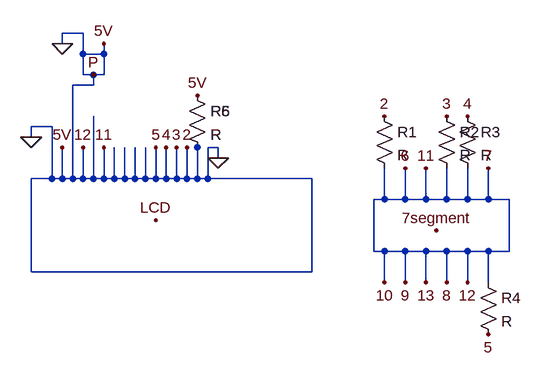
[diagram p0: schematic Polihack_circuit_arduino_pins.asc]
Polihack_circuit_arduino_pins.asc, the LTspice schematic file:
Version 4.1
SHEET 1 880 680
WIRE -496 -160 -528 -160
WIRE -528 -144 -528 -160
WIRE -496 -128 -496 -160
WIRE -464 -128 -464 -144
WIRE -464 -128 -496 -128
WIRE -496 -96 -496 -128
WIRE -480 -96 -496 -96
WIRE -464 -96 -464 -128
WIRE -464 -96 -480 -96
WIRE -480 -80 -480 -96
WIRE -480 -80 -512 -80
WIRE -544 -16 -576 -16
WIRE -576 0 -576 -16
WIRE -288 16 -304 16
WIRE -288 32 -288 16
WIRE -544 64 -544 -16
WIRE -544 64 -576 64
WIRE -528 64 -528 16
WIRE -528 64 -544 64
WIRE -512 64 -512 -80
WIRE -512 64 -528 64
WIRE -496 64 -496 16
WIRE -496 64 -512 64
WIRE -480 64 -480 -32
WIRE -480 64 -496 64
WIRE -464 64 -464 16
WIRE -464 64 -480 64
WIRE -448 64 -448 16
WIRE -448 64 -464 64
WIRE -432 64 -432 16
WIRE -432 64 -448 64
WIRE -416 64 -416 16
WIRE -416 64 -432 64
WIRE -400 64 -400 16
WIRE -400 64 -416 64
WIRE -384 64 -384 16
WIRE -384 64 -400 64
WIRE -368 64 -368 16
WIRE -368 64 -384 64
WIRE -352 64 -352 16
WIRE -352 64 -368 64
WIRE -336 64 -336 16
WIRE -336 64 -352 64
WIRE -320 64 -320 16
WIRE -320 64 -336 64
WIRE -304 64 -304 16
WIRE -304 64 -320 64
WIRE -144 64 -304 64
WIRE -32 96 -32 48
WIRE -32 96 -48 96
WIRE 0 96 0 48
WIRE 0 96 -32 96
WIRE 32 96 32 48
WIRE 32 96 0 96
WIRE 64 96 64 48
WIRE 64 96 32 96
WIRE 96 96 96 48
WIRE 96 96 64 96
WIRE 128 96 128 48
WIRE 128 96 96 96
WIRE 160 96 128 96
WIRE -48 176 -48 96
WIRE -32 176 -48 176
WIRE 0 176 -32 176
WIRE 32 176 0 176
WIRE 64 176 32 176
WIRE 96 176 64 176
WIRE 128 176 96 176
WIRE 160 176 160 96
WIRE 160 176 128 176
WIRE -576 208 -576 64
WIRE -144 208 -144 64
WIRE -144 208 -576 208
WIRE -32 224 -32 176
WIRE 0 224 0 176
WIRE 32 224 32 176
WIRE 64 224 64 176
WIRE 96 224 96 176
WIRE 128 224 128 176
FLAG -32 -32 2
FLAG 64 -32 3
FLAG 96 -32 4
FLAG 128 304 5
FLAG 0 48 6
FLAG 128 48 7
FLAG 64 224 8
FLAG 0 224 9
FLAG -32 224 10
FLAG 32 48 11
FLAG 96 224 12
FLAG 32 224 13
FLAG 48 144 7segment
FLAG -384 128 LCD
FLAG -480 -96 P
FLAG -320 -64 5V
FLAG -288 32 0
FLAG -336 16 2
FLAG -352 16 3
FLAG -368 16 4
FLAG -384 16 5
FLAG -496 16 12
FLAG -464 16 11
FLAG -464 -144 5V
FLAG -528 16 5V
FLAG -576 0 0
FLAG -528 -144 0
SYMBOL res -48 -48 R0
SYMATTR InstName R1
SYMBOL res 48 -48 R0
SYMATTR InstName R2
SYMBOL res 80 -48 R0
SYMATTR InstName R3
SYMBOL res 112 208 R0
SYMATTR InstName R4
SYMBOL res -336 -80 R0
SYMATTR InstName R5
SYMBOL res -336 -80 R0
SYMATTR InstName R6

The netlist it stands for:
* Polihack_circuit_arduino_pins.asc
R1 0 0 R
R2 0 0 R
R3 0 0 R
R4 0 0 R
R5 0 0 R
R6 0 0 R
.backanno
.end